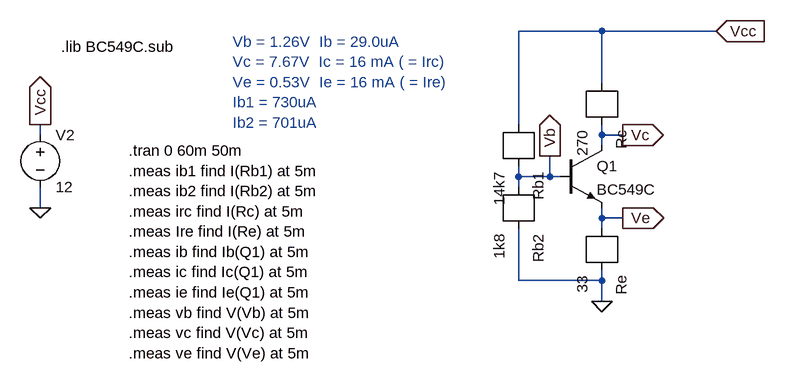
[diagram p0: schematic BC549C-amp-dc.asc]
BC549C-amp-dc.asc, the LTspice schematic file:
Version 4
SHEET 1 880 680
WIRE 592 80 464 80
WIRE 768 80 592 80
WIRE 592 160 592 80
WIRE 464 224 464 80
WIRE -272 240 -272 224
WIRE 592 240 592 224
WIRE 624 240 592 240
WIRE 592 256 592 240
WIRE 464 304 464 288
WIRE 512 304 512 272
WIRE 512 304 464 304
WIRE 528 304 512 304
WIRE 464 320 464 304
WIRE -272 352 -272 320
WIRE 592 368 592 352
WIRE 624 368 592 368
WIRE 592 384 592 368
WIRE 464 464 464 384
WIRE 592 464 592 448
WIRE 592 464 464 464
WIRE 592 496 592 464
FLAG -272 352 0
FLAG -272 224 Vcc
IOPIN -272 224 Out
FLAG 768 80 Vcc
IOPIN 768 80 In
FLAG 592 496 0
FLAG 624 368 Ve
IOPIN 624 368 Out
FLAG 624 240 Vc
IOPIN 624 240 Out
FLAG 512 272 Vb
IOPIN 512 272 Out
SYMBOL npn 528 256 R0
SYMATTR InstName Q1
SYMATTR Value BC549C
SYMBOL voltage -272 224 R0
SYMATTR InstName V2
SYMATTR Value 12
SYMBOL r 592 160 R90
SYMATTR InstName Rc
SYMATTR Value 270
SYMBOL r 464 224 R90
SYMATTR InstName Rb1
SYMATTR Value 14k7
SYMBOL r 464 320 R90
SYMATTR InstName Rb2
SYMATTR Value 1k8
SYMBOL r 592 384 R90
SYMATTR InstName Re
SYMATTR Value 33
TEXT -136 264 Left 2 !.tran 0 60m 50m\n.meas ib1 find I(Rb1) at 5m\n.meas ib2 find I(Rb2) at 5m\n.meas irc find I(Rc) at 5m\n.meas Ire find I(Re) at 5m\n.meas ib find Ib(Q1) at 5m\n.meas ic find Ic(Q1) at 5m\n.meas ie find Ie(Q1) at 5m\n.meas vb find V(Vb) at 5m\n.meas vc find V(Vc) at 5m\n.meas ve find V(Ve) at 5m
TEXT -240 104 Left 2 !.lib BC549C.sub
TEXT 24 96 Left 2 ;Vb = 1.26V  Ib = 29.0uA\nVc = 7.67V  Ic = 16 mA ( = Irc)\nVe = 0.53V  Ie = 16 mA ( = Ire)\nIb1 = 730uA\nIb2 = 701uA

The netlist it stands for:
* BC549C-amp-dc.asc
Q1 Vc Vb Ve 0 BC549C
V2 Vcc 0 12
Rc Vc Vcc 270
Rb1 Vb Vcc 14k7
Rb2 0 Vb 1k8
Re 0 Ve 33
.model NPN NPN
.model PNP PNP
.lib standard.bjt
.tran 0 60m 50m
.meas ib1 find I(Rb1) at 5m
.meas ib2 find I(Rb2) at 5m
.meas irc find I(Rc) at 5m
.meas Ire find I(Re) at 5m
.meas ib find Ib(Q1) at 5m
.meas ic find Ic(Q1) at 5m
.meas ie find Ie(Q1) at 5m
.meas vb find V(Vb) at 5m
.meas vc find V(Vc) at 5m
.meas ve find V(Ve) at 5m
.lib BC549C.sub
* Vb = 1.26V  Ib = 29.0uA
* Vc = 7.67V  Ic = 16 mA ( = Irc)
* Ve = 0.53V  Ie = 16 mA ( = Ire)
* Ib1 = 730uA
* Ib2 = 701uA
.backanno
.end